# EasyEDA schematic SCH_SrProj_v1.4.json
TITLE: ESP32 Scheme; REV: 1.0; Date: 2025-01-12; Sheet: 1/1; Drawn By: asula21; Company: Your Company
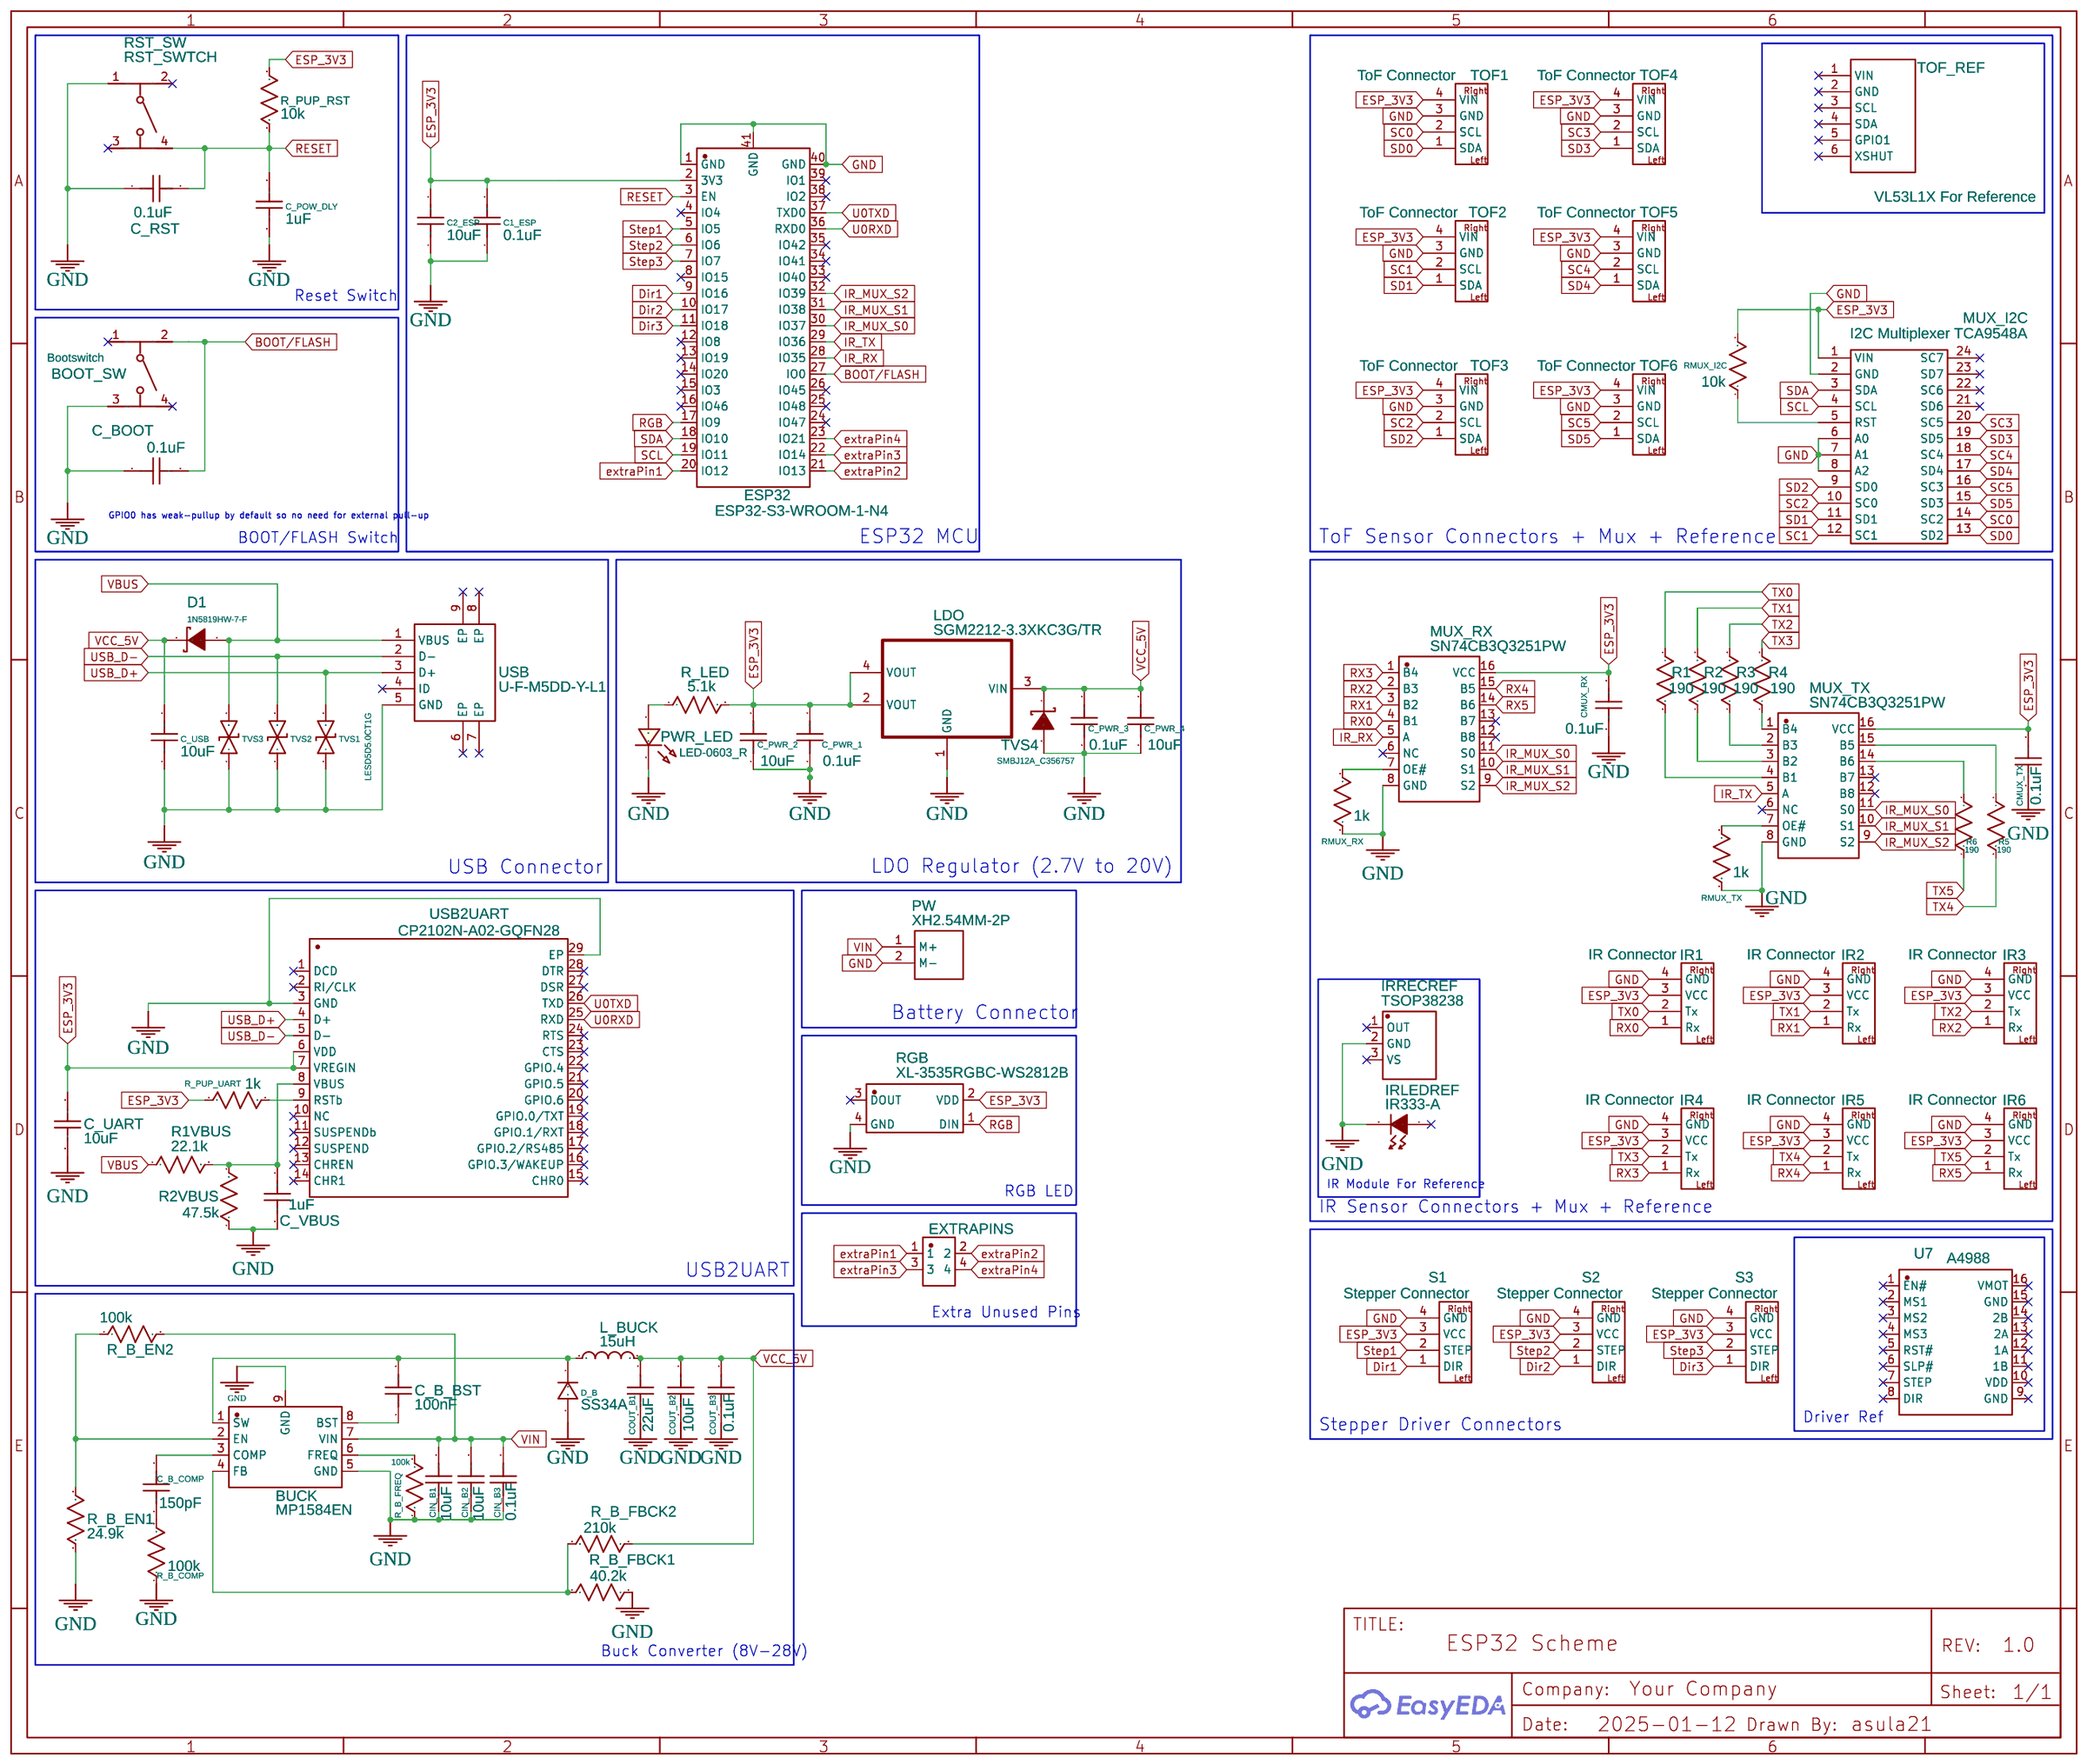
[diagram p0: schematic sheet]

## Parts
BOOT_SW  Bootswitch  [SW-TH_4P-L6.0-W6.0-P4.50-LS6.1]
BUCK  MP1584EN  [SOIC-8_L4.9-W3.9-P1.27-LS6.0-BL-EP3.3]
C1_ESP  0.1uF  [C0805]
C2_ESP  10uF  [C0805]
C_B_BST  100nF  [C0805]
C_B_COMP  150pF  [C0805]
C_BOOT  0.1uF  [C0805]
C_POW_DLY  1uF  [C0805]
C_PWR_1  0.1uF  [C0805]
C_PWR_2  10uF  [C0805]
C_PWR_3  0.1uF  [C0805]
C_PWR_4  10uF  [C0805]
C_RST  0.1uF  [C0805]
C_UART  10uF  [C0805]
C_USB  10uF  [C0805]
C_VBUS  1uF  [C0805]
CIN_B1  10uF  [C0805]
CIN_B2  10uF  [C0805]
CIN_B3  0.1uF  [C0805]
CMUX_RX  0.1uF  [C0805]
CMUX_TX  0.1uF  [C0805]
COUT_B1  22uF  [C0805]
COUT_B2  10uF  [C0805]
COUT_B3  0.1uF  [C0805]
D1  1N5819HW-7-F  [SOD-123_L2.7-W1.6-LS3.7-RD]
D_B  SS34A  [SMA_L4.3-W2.6-LS5.2-RD]
ESP32  ESP32-S3-WROOM-1-N4  [WIFIM-SMD_ESP32-S3-WROOM-1-N8]
EXTRAPINS  排母/2.54MM2X2直排母袋装环保  [HDR-TH_4P-P2.54-V-F-R2-C2-S2.54]
IR1  IR Connector  [MY CONECTOR_4.PIN_XH2.54MM]
IR2  IR Connector  [MY CONECTOR_4.PIN_XH2.54MM]
IR3  IR Connector  [MY CONECTOR_4.PIN_XH2.54MM]
IR4  IR Connector  [MY CONECTOR_4.PIN_XH2.54MM]
IR5  IR Connector  [MY CONECTOR_4.PIN_XH2.54MM]
IR6  IR Connector  [MY CONECTOR_4.PIN_XH2.54MM]
IRLEDREF  IR333-A  [LED-TH_BD6.2-P2.54-FD]
IRRECREF  TSOP38238  [SENSOR-TG_TSOP38236]
L_BUCK  15uH  [IND-SMD_CYH127-4.7UH]
LDO  SGM2212-3.3XKC3G/TR  [SOT-223-4_L6.5-W3.5-P2.30-LS7.0-BR]
MUX_I2C  I2C Multiplexer TCA9548A  [TCA9548A]
MUX_RX  SN74CB3Q3251PW  [TSSOP-16_L5.0-W4.4-P0.65-LS6.4-BL]
MUX_TX  SN74CB3Q3251PW  [TSSOP-16_L5.0-W4.4-P0.65-LS6.4-BL]
PW  XH2.54MM-2P  [XH2.54MM-2P]
PWR_LED  LED-0603_R  [LED0603_RED]
R1  190  [R0805]
R1VBUS  22.1k  [R0805]
R2  190  [R0805]
R2VBUS  47.5k  [R0805]
R3  190  [R0805]
R4  190  [R0805]
R5  190  [R0805]
R6  190  [R0805]
R_B_COMP  100k  [R0805]
R_B_EN1  24.9k  [R0805]
R_B_EN2  100k  [R0805]
R_B_FBCK1  40.2k  [R0805]
R_B_FBCK2  210k  [R0805]
R_B_FREQ  100k  [R0805]
R_LED  5.1k  [R0805]
R_PUP_RST  10k  [R0805]
R_PUP_UART  1k  [R0805]
RGB  XL-3535RGBC-WS2812B  [LED-SMD_XL-3535RGBC-WS2812B]
RMUX_I2C  10k  [R0805]
RMUX_RX  1k  [R0805]
RMUX_TX  1k  [R0805]
RST_SW  RST_SWTCH  [SW-TH_4P-L6.0-W6.0-P4.50-LS6.1]
S1  Stepper Connector  [MY CONECTOR_4.PIN_XH2.54MM]
S2  Stepper Connector  [MY CONECTOR_4.PIN_XH2.54MM]
S3  Stepper Connector  [MY CONECTOR_4.PIN_XH2.54MM]
TOF1  ToF Connector  [MY CONECTOR_4.PIN_XH2.54MM]
TOF2  ToF Connector  [MY CONECTOR_4.PIN_XH2.54MM]
TOF3  ToF Connector  [MY CONECTOR_4.PIN_XH2.54MM]
TOF4  ToF Connector  [MY CONECTOR_4.PIN_XH2.54MM]
TOF5  ToF Connector  [MY CONECTOR_4.PIN_XH2.54MM]
TOF6  ToF Connector  [MY CONECTOR_4.PIN_XH2.54MM]
TOF_REF  VL53L1X For Reference  [VL53L1X_BREAKOUT]
TVS1  LESD5D5.0CT1G  [SOD-523_L1.2-W0.8-LS1.6-BI]
TVS2  LESD5D5.0CT1G  [SOD-523_L1.2-W0.8-LS1.6-BI]
TVS3  LESD5D5.0CT1G  [SOD-523_L1.2-W0.8-LS1.6-BI]
TVS4  SMBJ12A_C356757  [SMB_L4.6-W3.6-LS5.4-RD]
U7  A4988  [DIP-16_L20.3-W15.2-P2.54_LS12.7_A4988]
USB  U-F-M5DD-Y-L1  [MICRO-USB-SMD_MICRO-USB-A8]
USB2UART  CP2102N-A02-GQFN28  [QFN-28_L5.0-W5.0-P0.50-TL-EP3.3]

## Library data of the parts
BOOT_SW RST_SW = Button-6x6x6mm: Supplier Part: C71836; Supplier: LCSC; Manufacturer: BBJ; Manufacturer Part: Switch,6*6*6Plastic head,260G, 0.25mm,Straight line
BUCK = MP1584EN: Contributor: LCSC; Supplier: LCSC; Supplier Part: C454188; Manufacturer: null; JLCPCB Part Class: Extended Part
C1_ESP C2_ESP C_B_BST C_B_COMP C_BOOT C_POW_DLY C_PWR_1-C_PWR_4 C_RST C_UART C_USB C_VBUS CIN_B1-CIN_B3 CMUX_RX CMUX_TX COUT_B1-COUT_B3 = C_0603_US: Contributor: LCEDA_Lib
D1 = 1N5819HW-7-F: Supplier: LCSC; Manufacturer: DIODES(美台); Supplier Part: C82544; JLCPCB Part Class: Extended Part
D_B = SS34A: Contributor: LCSC; Supplier: LCSC; Supplier Part: C211775; Manufacturer: YANGJIE(扬杰); JLCPCB Part Class: Extended Part
ESP32 = ESP32-S3-WROOM-1-N4: Supplier: LCSC; Supplier Part: C2913197; Manufacturer: ESPRESSIF(乐鑫); JLCPCB Part Class: Extended Part; Contributor: lcsc; link: https://lcsc.com/eda_search?q=C2913197&%26type=1&ref=editor
EXTRAPINS = 排母/2.54MM2X2直排母袋装环保: Contributor: LCSC; Supplier: LCSC; Supplier Part: C47553; Manufacturer: BOOMELE(博穆精密); Manufacturer Part: 排母/2.54mm2x2直排母袋装环保; JLCPCB Part Class: Extended Part
IR1-IR6 S1-S3 TOF1-TOF6 = MY XH2.54MM.4P: Contributor: amocachi
IRLEDREF = IR333-A: Contributor: LCSC; Supplier: LCSC; Supplier Part: C95407; Manufacturer: EVERLIGHT(亿光); JLCPCB Part Class: Extended Part; link: https://lcsc.com/eda_search?q=C95407&%26type=1&ref=editor
IRRECREF = TSOP38238: Contributor: LCSC; Supplier: LCSC; Manufacturer: VISHAY(威世); Supplier Part: C141632; JLCPCB Part Class: Extended Part; link: https://lcsc.com/eda_search?q=C141632&%26type=1&ref=editor
L_BUCK = CYH127-4.7UH: Supplier: LCSC; Supplier Part: C7431091; Manufacturer: SHOU HAN(首韩); JLCPCB Part Class: Extended Part; Contributor: lcsc
LDO = SGM2212-3.3XKC3G/TR: Contributor: lcsc; Supplier: LCSC; Supplier Part: C9900018517; Manufacturer: null; JLCPCB Part Class: Extended Part
MUX_I2C = TCA9548A I2C MULTIPLEXER 8 CHANEL: Manufacturer: IDSN; Manufacturer Part: IDSN-TCA9548A; Supplier Part: IDSN-TCA9548A; Supplier: IDSN; Contributor: limjohandi
MUX_RX MUX_TX = SN74CB3Q3251PW: Contributor: LCSC; Supplier: LCSC; Supplier Part: C2866862; Manufacturer: TI(德州仪器); JLCPCB Part Class: Extended Part
PW = PH2.0-2P: Manufacturer Part: Header P2 PH2.0 TUANLE; Contributor: thanhtradt12; Package Display: No
PWR_LED = LED-0603_R: Manufacturer: EVERLIGHT(台湾亿光); Manufacturer Part: 19-217/R6C-AL1M2VY/3T; Supplier Part: C72044; Supplier: LCSC; Contributor: LCEDA_01
R1-R6 = R_0805_US: Contributor: LCEDA_Lib
R1VBUS R2VBUS R_B_COMP R_B_EN1 R_B_EN2 R_B_FBCK1 R_B_FBCK2 R_B_FREQ R_LED R_PUP_RST R_PUP_UART RMUX_I2C RMUX_RX RMUX_TX = R_0603_US: Contributor: LCEDA_Lib
RGB = XL-3535RGBC-WS2812B: Contributor: LCSC; Supplier: LCSC; Supplier Part: C2843786; Manufacturer: XINGLIGHT(成兴光); JLCPCB Part Class: Extended Part
TOF_REF = VL53L1X_BREAKOUT: Manufacturer Part: VL53L0X Time-of-Flight Distance Sensor VL53L0X; Contributor: freddyka
TVS1-TVS3 = LESD5D5.0CT1G: Contributor: LCSC; Supplier: LCSC; Supplier Part: C383211; Manufacturer: LRC(乐山无线电); JLCPCB Part Class: Extended Part
TVS4 = SMBJ12A_C356757: Contributor: LCSC; Supplier: LCSC; Supplier Part: C356757; Manufacturer: JJW(捷捷微); Manufacturer Part: SMBJ12A; JLCPCB Part Class: Extended Part
U7 = A4988: Supplier: LCSC; Supplier Part: C9900168373; Manufacturer: null; Contributor: lcsc
USB = U-F-M5DD-Y-L1: Contributor: LCSC; Supplier: LCSC; Manufacturer: 韩国韩荣; Supplier Part: C145791; JLCPCB Part Class: Extended Part
USB2UART = CP2102N-A02-GQFN28: Contributor: LCSC; Supplier: LCSC; Supplier Part: C1550553; Manufacturer: SKYWORKS/SILICON LABS(芯科); JLCPCB Part Class: Extended Part; Package Display: No

## Nets
GND: BOOT_SW.3 BUCK.5(GND) BUCK.9(GND) C1_ESP.1 C2_ESP.1 C_BOOT.1 C_POW_DLY.1 C_PWR_1.1 C_PWR_2.1 C_PWR_3.1 C_PWR_4.1 C_RST.1 C_UART.1 C_USB.1 C_VBUS.2 CIN_B1.1 CIN_B2.1 CIN_B3.1 CMUX_RX.1 CMUX_TX.1 COUT_B1.1 COUT_B2.1 COUT_B3.1 D_B.2(A) ESP32.1(GND) ESP32.40(GND) ESP32.41(GND) IR1.4(GND) IR2.4(GND) IR3.4(GND) IR4.4(GND) IR5.4(GND) IR6.4(GND) IRLEDREF.2(C) IRRECREF.2(GND) LDO.1(GND) MUX_I2C.2(GND) MUX_I2C.6(A0) MUX_I2C.7(A1) MUX_I2C.8(A2) MUX_RX.8(GND) MUX_TX.8(GND) PW.2(M-) PWR_LED.2 R2VBUS.1 R_B_COMP.1 R_B_EN1.1 R_B_FBCK1.2 R_B_FREQ.1 RGB.4(GND) RMUX_RX.1 RMUX_TX.1 RST_SW.1 S1.4(GND) S2.4(GND) S3.4(GND) TOF1.3(GND) TOF2.3(GND) TOF3.3(GND) TOF4.3(GND) TOF5.3(GND) TOF6.3(GND) TVS1.1 TVS2.1 TVS3.1 TVS4.2(A) USB.5(GND) USB2UART.3(GND) USB2UART.29(EP)
VBUS: D1.2(A) R1VBUS.1 TVS3.2 USB.1(VBUS)
VCC_5V: C_PWR_3.2 C_PWR_4.2 C_USB.2 COUT_B1.2 COUT_B2.2 COUT_B3.2 D1.1(K) L_BUCK.2 LDO.3(VIN) R_B_FBCK2.1 TVS4.1(K)
VIN: BUCK.7(VIN) CIN_B1.2 CIN_B2.2 CIN_B3.2 PW.1(M+) R_B_EN2.2
BOOT/FLASH: BOOT_SW.2 C_BOOT.2 ESP32.27(IO0)
Dir1: ESP32.9(IO16) S1.1(DIR)
Dir2: ESP32.10(IO17) S2.1(DIR)
Dir3: ESP32.11(IO18) S3.1(DIR)
ESP_3V3: C1_ESP.2 C2_ESP.2 C_PWR_1.2 C_PWR_2.2 C_UART.2 CMUX_RX.2 CMUX_TX.2 ESP32.2(3V3) IR1.3(VCC) IR2.3(VCC) IR3.3(VCC) IR4.3(VCC) IR5.3(VCC) IR6.3(VCC) LDO.2(VOUT) LDO.4(VOUT) MUX_I2C.1(VIN) MUX_RX.16(VCC) MUX_TX.16(VCC) R_LED.2 R_PUP_RST.2 R_PUP_UART.2 RGB.2(VDD) RMUX_I2C.2 S1.3(VCC) S2.3(VCC) S3.3(VCC) TOF1.4(VIN) TOF2.4(VIN) TOF3.4(VIN) TOF4.4(VIN) TOF5.4(VIN) TOF6.4(VIN) USB2UART.6(VDD) USB2UART.7(VREGIN)
extraPin1: ESP32.20(IO12) EXTRAPINS.1
extraPin2: ESP32.21(IO13) EXTRAPINS.2
extraPin3: ESP32.22(IO14) EXTRAPINS.3
extraPin4: ESP32.23(IO21) EXTRAPINS.4
IR_MUX_S0: ESP32.30(IO37) MUX_RX.11(S0) MUX_TX.11(S0)
IR_MUX_S1: ESP32.31(IO38) MUX_RX.10(S1) MUX_TX.10(S1)
IR_MUX_S2: ESP32.32(IO39) MUX_RX.9(S2) MUX_TX.9(S2)
IR_RX: ESP32.28(IO35) MUX_RX.5(A)
IR_TX: ESP32.29(IO36) MUX_TX.5(A)
RESET: C_POW_DLY.2 C_RST.2 ESP32.3(EN) R_PUP_RST.1 RST_SW.4
RGB: ESP32.17(IO9) RGB.1(DIN)
RX0: IR1.1(Rx) MUX_RX.4(B1)
RX1: IR2.1(Rx) MUX_RX.3(B2)
RX2: IR3.1(Rx) MUX_RX.2(B3)
RX3: IR4.1(Rx) MUX_RX.1(B4)
RX4: IR5.1(Rx) MUX_RX.15(B5)
RX5: IR6.1(Rx) MUX_RX.14(B6)
SC0: MUX_I2C.14(SC2) TOF1.2(SCL)
SC1: MUX_I2C.12(SC1) TOF2.2(SCL)
SC2: MUX_I2C.10(SC0) TOF3.2(SCL)
SC3: MUX_I2C.20(SC5) TOF4.2(SCL)
SC4: MUX_I2C.18(SC4) TOF5.2(SCL)
SC5: MUX_I2C.16(SC3) TOF6.2(SCL)
SCL: ESP32.19(IO11) MUX_I2C.4(SCL)
SD0: MUX_I2C.13(SD2) TOF1.1(SDA)
SD1: MUX_I2C.11(SD1) TOF2.1(SDA)
SD2: MUX_I2C.9(SD0) TOF3.1(SDA)
SD3: MUX_I2C.19(SD5) TOF4.1(SDA)
SD4: MUX_I2C.17(SD4) TOF5.1(SDA)
SD5: MUX_I2C.15(SD3) TOF6.1(SDA)
SDA: ESP32.18(IO10) MUX_I2C.3(SDA)
Step1: ESP32.5(IO5) S1.2(STEP)
Step2: ESP32.6(IO6) S2.2(STEP)
Step3: ESP32.7(IO7) S3.2(STEP)
TX0: IR1.2(Tx) R1.1
TX1: IR2.2(Tx) R2.2
TX2: IR3.2(Tx) R3.2
TX3: IR4.2(Tx) R4.2
TX4: IR5.2(Tx) R5.2
TX5: IR6.2(Tx) R6.1
U0RXD: ESP32.36(RXD0) USB2UART.25(RXD)
U0TXD: ESP32.37(TXD0) USB2UART.26(TXD)
USB_D+: TVS1.2 USB.3(D+) USB2UART.4(D+)
USB_D-: TVS2.2 USB.2(D-) USB2UART.5(D-)
Net-(BUCK-1): BUCK.1(SW) C_B_BST.2 D_B.1(C) L_BUCK.1
Net-(BUCK-2): BUCK.2(EN) R_B_EN1.2 R_B_EN2.1
Net-(BUCK-3): BUCK.3(COMP) C_B_COMP.2
Net-(BUCK-4): BUCK.4(FB) R_B_FBCK1.1 R_B_FBCK2.2
Net-(BUCK-6): BUCK.6(FREQ) R_B_FREQ.2
Net-(BUCK-8): BUCK.8(BST) C_B_BST.1
Net-(C_B_COMP-1): C_B_COMP.1 R_B_COMP.2
Net-(C_VBUS-1): C_VBUS.1 R1VBUS.2 R2VBUS.2 USB2UART.8(VBUS)
Net-(MUX_I2C-5): MUX_I2C.5(RST) RMUX_I2C.1
Net-(MUX_RX-7): MUX_RX.7(OE#) RMUX_RX.2
Net-(MUX_TX-1): MUX_TX.1(B4) R4.1
Net-(MUX_TX-2): MUX_TX.2(B3) R3.1
Net-(MUX_TX-3): MUX_TX.3(B2) R2.1
Net-(MUX_TX-4): MUX_TX.4(B1) R1.2
Net-(MUX_TX-7): MUX_TX.7(OE#) RMUX_TX.2
Net-(MUX_TX-14): MUX_TX.14(B6) R6.2
Net-(MUX_TX-15): MUX_TX.15(B5) R5.1
Net-(PWR_LED-1): PWR_LED.1 R_LED.1
Net-(R_PUP_UART-1): R_PUP_UART.1 USB2UART.9(RSTb)

Not connected (* = marked no-connect by the designer): BOOT_SW 1* 4*; ESP32 4(IO4)* 8(IO15)* 12(IO8)* 13(IO19)* 14(IO20)* 15(IO3)* 16(IO46)* 24(IO47)* 25(IO48)* 26(IO45)* 33(IO40)* 34(IO41)* 35(IO42)* 38(IO2)* 39(IO1)*; IRLEDREF 1(A)*; IRRECREF 1(OUT)* 3(VS)*; MUX_I2C 21(SD6)* 22(SC6)* 23(SD7)* 24(SC7)*; MUX_RX 6(NC)* 12(B8)* 13(B7)*; MUX_TX 6(NC)* 12(B8)* 13(B7)*; RGB 3(DOUT)*; RST_SW 2* 3*; TOF_REF 1(VIN)* 2(GND)* 3(SCL)* 4(SDA)* 5(GPIO1)* 6(XSHUT)*; U7 1(EN#)* 2(MS1)* 3(MS2)* 4(MS3)* 5(RST#)* 6(SLP#)* 7(STEP)* 8(DIR)* 9(GND)* 10(VDD)* 11(1B)* 12(1A)* 13(2A)* 14(2B)* 15(GND)* 16(VMOT)*; USB 4(ID)* 6(EP)* 7(EP)* 8(EP)* 9(EP)*; USB2UART 1(DCD)* 2(RI/CLK)* 10(NC)* 11(SUSPENDb)* 12(SUSPEND)* 13(CHREN)* 14(CHR1)* 15(CHR0)* 16(GPIO.3/WAKEUP)* 17(GPIO.2/RS485)* 18(GPIO.1/RXT)* 19(GPIO.0/TXT)* 20(GPIO.6)* 21(GPIO.5)* 22(GPIO.4)* 23(CTS)* 24(RTS)* 27(DSR)* 28(DTR)*

## Notes on the sheet
- Reset Switch
- GPIO0 has weak-pullup by default so no need for external pull-up
- BOOT/FLASH Switch
- ESP32 MCU
- ToF Sensor Connectors + Mux + Reference
- USB Connector
- LDO Regulator (2.7V to 20V)
- Battery Connector
- IR Module For Reference
- RGB LED
- IR Sensor Connectors + Mux + Reference
- USB2UART
- Extra Unused Pins
- Stepper Driver Connectors
- Driver Ref
- Buck Converter (8V-28V)
